# EAGLE design v3c (EAGLE 8.4.1)
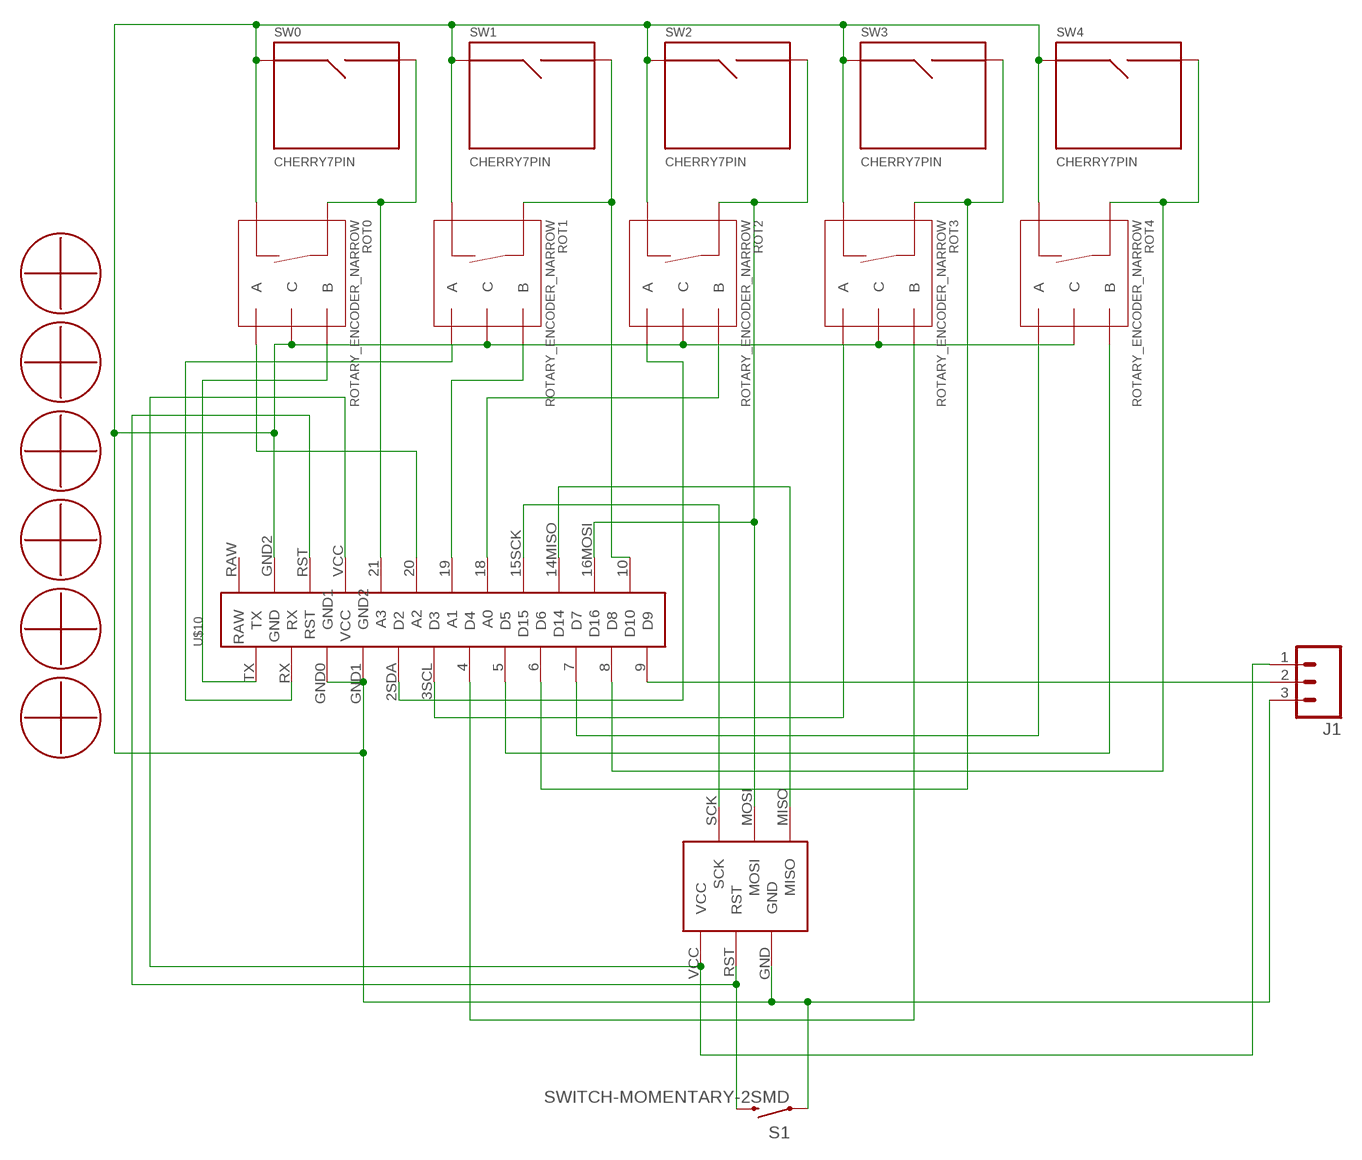
[diagram p0: schematic, sheet 1]

## Parts
J1  M031X03_NO_SILK  [1X03_NO_SILK]
ROT0  ROTARY_ENCODER_NARROW  [ROTARY_ENC_NARROW]
ROT1  ROTARY_ENCODER_NARROW  [ROTARY_ENC_NARROW]
ROT2  ROTARY_ENCODER_NARROW  [ROTARY_ENC_NARROW]
ROT3  ROTARY_ENCODER_NARROW  [ROTARY_ENC_NARROW]
ROT4  ROTARY_ENCODER_NARROW  [ROTARY_ENC_NARROW]
S1  SWITCH-MOMENTARY-2SMD  [TACTILE_SWITCH_SMD]
SW0  CHERRY7PIN  [CHERRY5HOLE]
SW1  CHERRY7PIN  [CHERRY5HOLE]
SW2  CHERRY7PIN  [CHERRY5HOLE]
SW3  CHERRY7PIN  [CHERRY5HOLE]
SW4  CHERRY7PIN  [CHERRY5HOLE]
U$1  ICSP  [ICSP]
U$2  M2MOUNT  [M2MOUNT]
U$3  M2MOUNT  [M2MOUNT]
U$10  PROMICROLOCK  [PROMICRO-LOCK]
U$12  M2MOUNT  [M2MOUNT]
U$13  M2MOUNT  [M2MOUNT]
U$15  M2MOUNT  [M2MOUNT]
U$17  M2MOUNT  [M2MOUNT]

## Nets
2: ROT2.A U$10.2SDA(D2)
3: ROT3.A U$10.3SCL(D3)
4: ROT3.B U$10.4(D4)
5: ROT4.B U$10.5(D5)
6: ROT3.SW+ SW3.P$2(SIG2) U$10.6(D6)
7: ROT4.A U$10.7(D7)
8: ROT4.SW+ SW4.P$2(SIG2) U$10.8(D8)
10: ROT1.SW+ SW1.P$2(SIG2) U$10.10(D10)
18: ROT2.B U$10.18(A0)
19: ROT1.B U$10.19(A1)
20: ROT0.A U$10.20(A2)
21: ROT0.SW+ SW0.P$2(SIG2) U$10.21(A3)
GND: J1.3 ROT0.C ROT0.SW- ROT1.C ROT1.SW- ROT2.C ROT2.SW- ROT3.C ROT3.SW- ROT4.C ROT4.SW- S1.1 SW0.P$1(SIG1) SW1.P$1(SIG1) SW2.P$1(SIG1) SW3.P$1(SIG1) SW4.P$1(SIG1) U$1.GND U$10.GND0(GND1) U$10.GND1(GND2) U$10.GND2(GND)
LEDOUT: J1.2 U$10.9(D9)
MISO: U$1.MISO U$10.14MISO(D14)
MOSI: ROT2.SW+ SW2.P$2(SIG2) U$1.MOSI U$10.16MOSI(D16)
RST: S1.3 U$1.RST U$10.RST
RX: ROT1.A U$10.RX
SCK: U$1.SCK U$10.15SCK(D15)
TX: ROT0.B U$10.TX
VCC: J1.1 U$1.VCC U$10.VCC
Unconnected: U$10.RAW

## Library data of the parts
J1 = SparkFun-Connectors:M03: Header 3 Standard 3-pin 0.1" header. Use with straight break away headers (SKU : PRT-00116), right angle break away headers (PRT-00553), swiss pins (PRT-00743), machine pins (PRT-00117), and female headers (PRT-00115). Molex polarized connector foot print use with SKU : PRT-08232 with associated crimp pins and housings.
ROT0 ROT1-ROT4 = GardnerCustom:ROTARY_ENCODER_NARROW
S1 = GardnerCustom:SWITCH-MOMENTARY-2: Various NO switches- pushbuttons, reed, etc; PROD_ID: SWCH-08247
SW0 SW1-SW4 = GardnerCustom:CHERRY7PIN
U$1 = GardnerCustom:ICSP
U$2 U$3 U$12 U$13 U$15 U$17 = GardnerCustom:M2MOUNT
U$10 = GardnerCustom:PROMICROLOCK

## Board
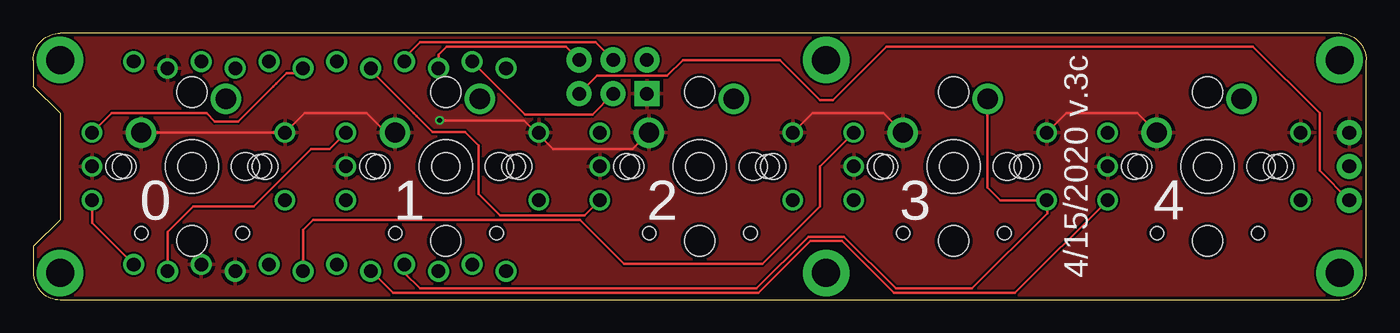
[diagram p1: board, top side]
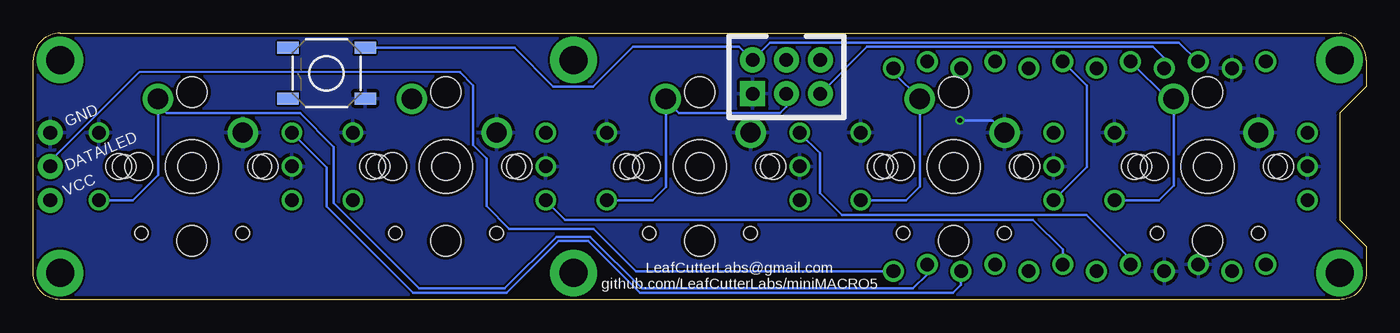
[diagram p2: board, bottom side, seen from below]

Size 100 x 20 mm. Coordinates in mm from the lower left corner, seen from the top.
Outline: 2,0 98,0 arc90 100,2 100,18 arc90 98,20 2,20 arc90 0,18 0,16 2,14 2,6 0,4 0,2 arc90 2,0
Copper layers (1*16): Top 0.035mm / dielectric 1.5mm / Bottom 0.035mm
Design rules "SeeedStudio_2layer_DRU_no_angle_20140221": minimum track width 6mil, minimum drill 12mil, track to track 6mil, track to pad 6mil, pad to pad 6mil, via to via 6mil, smd to smd 0mil, copper to edge 10mil, drill to drill 10mil, minimum pad ring 10mil, minimum via ring 6mil, stop-mask expansion 2mil, vias tented up to drill 100mil, thermal gap 10mil

### Footprints (pad centres in the part's own frame; a part is rotated, then mirrored left to right if it is on the bottom)
1X03_NO_SILK = drill 1.016 pad 1.88: 1 0,0; 2 2.54,0; 3 5.08,0
ROTARY_ENC_NARROW = drill 1.016: A 7.493,-2.54; B 7.493,2.54; C 7.493,0; SW+ -6.985,2.54; SW- -6.985,-2.54 | hole 2.1: 0,0; -4,0 | hole 2.286: 0,5.588; 0,-5.588
TACTILE_SWITCH_SMD = smd 1.6 x 0.9: 1 -2.9,1.905; 2 2.9,1.905; 3 -2.9,-1.905; 4 2.9,-1.905
CHERRY5HOLE = drill 1.524: P$1 -3.81,2.54; P$2 2.54,5.08 | hole 4: 0,0 | hole 1.778: -5.08,0; 5.08,0 | hole 1.9: -5.5,0; 5.5,0 | hole 1: -3.8,-5; 3.8,-5
ICSP = drill 1.016 pad 1.88 square: GND -2.54,-1.27 | drill 1.016 pad 1.88: MISO 2.54,1.27; MOSI 0,-1.27; RST -2.54,1.27; SCK 0,1.27; VCC 2.54,-1.27
M2MOUNT = drill 2.1 pad 3.5: P$1 0,0
PROMICRO-LOCK = drill 1.016 pad 1.575: 2SDA -7.366,3.81; 3SCL -7.874,1.27; 4 -7.366,-1.27; 5 -7.874,-3.81; 6 -7.366,-6.35; 7 -7.874,-8.89; 8 -7.366,-11.43; 9 -7.874,-13.97; 10 7.366,-13.97; 14MISO 7.366,-8.89; 15SCK 7.874,-6.35; 16MOSI 7.874,-11.43; 18 7.366,-3.81; 19 7.874,-1.27; 20 7.366,1.27; 21 7.874,3.81; GND0 -7.366,8.89; GND1 -7.874,6.35; RAW 7.874,13.97; RST 7.874,8.89; RX -7.874,11.43; TX -7.366,13.97; VCC 7.366,6.35 | drill 1.016 pad 1.549: GND2 7.366,11.43

### Placement (x,y rotation side)
J1  98.73,7.46 90 top
ROT0  11.9,10 180 top
ROT1  30.95,10 180 top
ROT2  50,10 180 top
ROT3  69.05,10 180 top
ROT4  88.1,10 180 top
S1  78,17 180 bottom
SW0  11.9,10 0 top
SW1  30.95,10 0 top
SW2  50,10 0 top
SW3  69.05,10 0 top
SW4  88.1,10 0 top
U$1  43.5,16.73 0 bottom
U$2  59.48,2 0 top
U$3  59.48,18 0 top
U$10  21.5,10 90 top
U$12  98,18 0 top
U$13  2,2 0 top
U$15  2,18 0 top
U$17  98,2 0 top

### Tracks (layer width: path | path; a pad name or v marks a point on that pad's centre or on a via)
2
  Bottom 0.17: ROT2.A 42.51,12.51 41,11 41,8 39.35,6.35 21,6.35 17.69,3.04 U$10.2SDA
3
  Top 0.17: ROT3.A 59,9.98 59,7 54.7,2.7 44.3,2.7 41,6 21,6 20.23,5.23 U$10.3SCL
4
  Bottom 0.17: ROT3.B 60.1,6 25,6 22.77,3.77 U$10.4
5
  Top 0.17: ROT4.B 73.66,0.51 64.58,0.51 60.69,4.4 58.3,4.4 54.41,0.51 54.17,0.51 54,0.51 27,0.51 25.38,2.13 U$10.5
6
  Top 0.17: 54,0.83 29,0.83 27.85,1.98 U$10.6 | 54,0.83 54.04,0.83 | SW3.P$2 71.59,8.41 72.54,7.46 ROT3.SW+ 76.07,7.42 76.07,6.48 70.43,0.83 64.71,0.83 60.82,4.72 58.17,4.72 54.27,0.83 54.04,0.83 | 54,0.83 54.04,0.83
7
  Bottom 0.17: ROT4.A 78,9.93 78,7 71.51,0.51 64.49,0.51 60.6,4.4 58.36,4.4 54.47,0.51 54,0.51 31,0.51 30.39,1.12 U$10.7
8
  Bottom 0.17: 54,0.83 34,0.83 32.93,1.9 U$10.8 | 54,0.83 54.34,0.83 | ROT4.SW+ 92.54,7.46 90.64,9.36 SW4.P$2 90.64,14.64 90,14 80,14 77.47,11.47 77.47,7.24 71.06,0.83 64.63,0.83 60.73,4.72 58.23,4.72 54.34,0.83 | 54,0.83 54.34,0.83
10
  Bottom 0.17: ROT1.SW+ 34.54,7.46 33.49,8.51 SW1.P$2 35.47,17.06 U$10.10
18
  Top 0.17: ROT2.B 41.37,6.32 35,6.32 33.4,7.92 33.4,11.56 32.38,12.57 29.97,12.57 28.77,13.77 28.55,14 25.31,17.23 U$10.18
19
  Bottom 0.17: ROT1.B 20.96,9.96 20.96,16.06 U$10.19
20
  Top 0.17: ROT0.A 5.87,14 13,14 13.62,13.38 15.38,13.38 18,16 | 18,16 18.23,16.23 | 18,16 19,17 19.86,17 U$10.20
21
  Bottom 0.17: ROT0.SW+ 15.54,7.46 14.44,8.56 SW0.P$2 14.9,15.08 U$10.21
GND  (via drill 0.35)
  Top 0.17: SW3.P$1 63.78,14 58.45,14 ROT2.SW- 56.29,12.54 | SW1.P$1 26.46,12.54 25,14 20.34,14 ROT0.SW- SW0.P$1 | 37.94,12.36 ROT1.SW- | 37.94,12.36 38.99,11.3 44.95,11.3 SW2.P$1 | v30.48,13.46 36.83,13.46 37.94,12.36 | ROT3.SW- 77.5,14 82.83,14 SW4.P$1
  Bottom 0.17: SW1.P$1 28.06,13.46 v30.48,13.46
  pour Top: 0,0 100,0 100,20 0,20
  pour Bottom: 0,0 100,0 100,20 0,20
LEDOUT
  Bottom 0.152: 68,17.07 92.05,17.07 98.6,10.52 98.6,10.06 J1.2
  Bottom 0.17: 68,17.07 67,16.07 67,11.6 66,10.6 66,7.02 64.29,5.31 57.95,5.31 54.77,2.13 U$10.9
MISO
  Top 0.17: U$1.MISO 39.96,19 31,19 30.39,18.39 U$10.14MISO
MOSI
  Top 0.17: U$10.16MOSI 36.9,13.9 41.94,13.9 U$1.MOSI
  Bottom 0.17: 52.54,15 52.54,8.46 53.54,7.46 ROT2.SW+ | 52.54,15 SW2.P$2 | 51.54,14 52.54,15 | 51.77,14.23 51.54,14 | 51.54,14 44,14 43.5,14.5 U$1.MOSI
RST
  Bottom 0.17: U$10.RST 14.04,19.3 44.74,19.3 U$1.RST
  Bottom 0.2: U$1.RST 47.04,19 55,19 58,16 60.3,16 60.31,16 61,16 63.91,18.91 S1.3
RX
  Top 0.17: ROT1.A 22.22,11.3 20.83,11.3 16.52,7 12,7 10.07,5.07 U$10.RX
SCK
  Top 0.17: U$1.SCK 42.18,19.32 39.15,19.32 39,19.32 29,19.32 27.85,18.17 U$10.15SCK
TX
  Top 0.17: ROT0.B 4.41,5.76 U$10.TX
VCC
  Top 0.2: U$1.VCC 42.31,16.81 47.53,16.81 48.73,18 56,18 59,15 60,15 64,19 91.5,19 96.5,14 96.5,9.69 J1.1
  Bottom 0.17: U$10.VCC 15.15,18.13 16,18.98 37.44,18.98 U$1.VCC

### Text on the board
tPlace: 4/15/2020 v.3c | 0 | 1 | 2 | 3 | 4
bPlace: GND | DATA/LED | VCC | LeafCutterLabs@gmail.com / github.com/LeafCutterLabs/miniMACRO5
bStop: miniMACRO5